# EasyEDA schematic 1-Schematic_New Projec.json
TITLE: Sheet_1; REV: 1.0; Date: 2024-03-21; Sheet: 1/1; Drawn By: rit03452; Company: Your Company
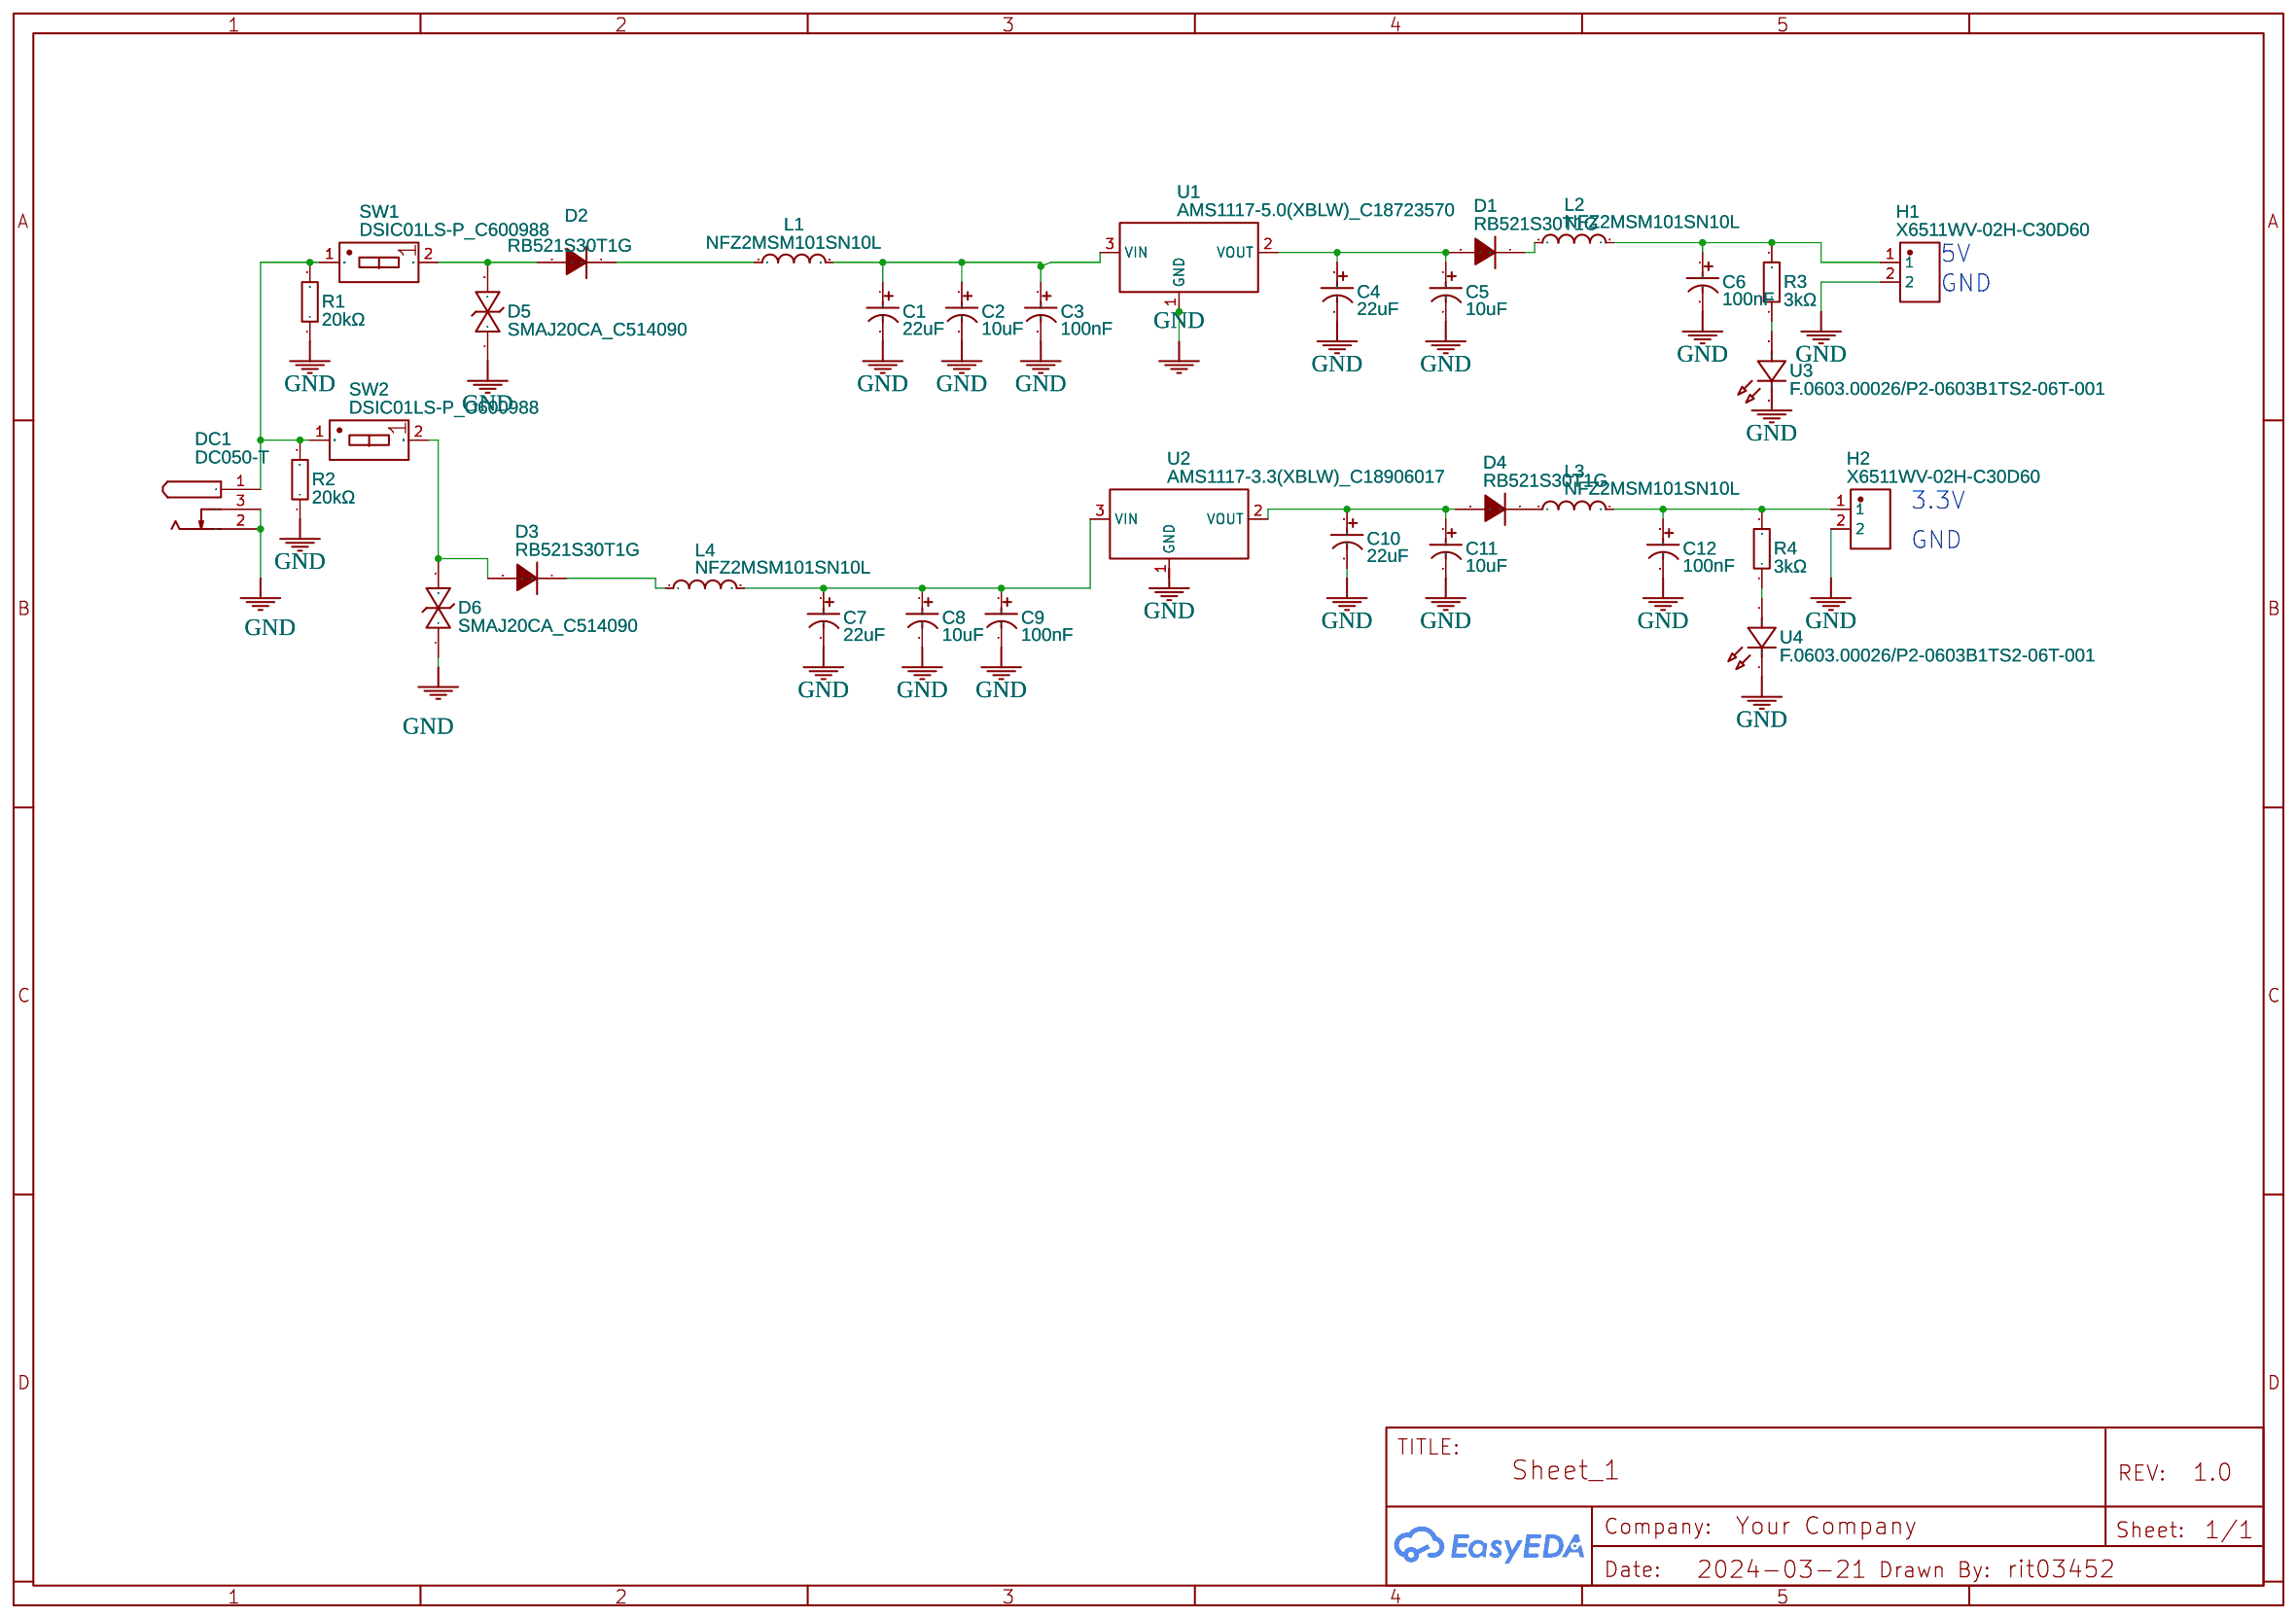
[diagram p0: schematic sheet]

## Parts
C1  22uF  [CAP-TH_BD5.0-P2.00-D0.8-FD]
C2  10uF  [CAP-TH_BD5.0-P2.00-D0.8-FD]
C3  100nF  [CAP-TH_BD5.0-P2.00-D0.8-FD]
C4  22uF  [CAP-TH_BD5.0-P2.00-D0.8-FD]
C5  10uF  [CAP-TH_BD5.0-P2.00-D0.8-FD]
C6  100nF  [CAP-TH_BD5.0-P2.00-D0.8-FD]
C7  22uF  [CAP-TH_BD5.0-P2.00-D0.8-FD]
C8  10uF  [CAP-TH_BD5.0-P2.00-D0.8-FD]
C9  100nF  [CAP-TH_BD5.0-P2.00-D0.8-FD]
C10  22uF  [CAP-TH_BD5.0-P2.00-D0.8-FD]
C11  10uF  [CAP-TH_BD5.0-P2.00-D0.8-FD]
C12  100nF  [CAP-TH_BD5.0-P2.00-D0.8-FD]
D1  RB521S30T1G  [SOD-523_L1.2-W0.8-LS1.6-RD]
D2  RB521S30T1G  [SOD-523_L1.2-W0.8-LS1.6-RD]
D3  RB521S30T1G  [SOD-523_L1.2-W0.8-LS1.6-RD]
D4  RB521S30T1G  [SOD-523_L1.2-W0.8-LS1.6-RD]
D5  SMAJ20CA_C514090  [SMA_L4.3-W2.6-LS5.2-BI]
D6  SMAJ20CA_C514090  [SMA_L4.3-W2.6-LS5.2-BI]
DC1  DC050-T  [DC-IN_DC050-T]
H1  X6511WV-02H-C30D60  [HDR-TH_2P-P2.54-V-M]
H2  X6511WV-02H-C30D60  [HDR-TH_2P-P2.54-V-M]
L1  NFZ2MSM101SN10L  [L0806]
L2  NFZ2MSM101SN10L  [L0806]
L3  NFZ2MSM101SN10L  [L0806]
L4  NFZ2MSM101SN10L  [L0806]
R1  20kΩ  [R0603]
R2  20kΩ  [R0603]
R3  3kΩ  [R0402]
R4  3kΩ  [R0402]
SW1  DSIC01LS-P_C600988  [SW-SMD_2P-L3.5-W6.2-P2.54-LS9.8]
SW2  DSIC01LS-P_C600988  [SW-SMD_2P-L3.5-W6.2-P2.54-LS9.8]
U1  AMS1117-5.0(XBLW)_C18723570  [SOT-223-3_L6.5-W3.4-P2.30-LS7.0-BR-1]
U2  AMS1117-3.3(XBLW)_C18906017  [SOT-223-3_L6.5-W3.4-P2.30-LS7.0-BR-1]
U3  F.0603.00026/P2-0603B1TS2-06T-001  [LED0603-RD]
U4  F.0603.00026/P2-0603B1TS2-06T-001  [LED0603-RD]

## Library data of the parts
C1 C4 C7 C10 = 22uF 50V 5*11: Supplier: LCSC; Manufacturer: CX(承兴); Manufacturer Part: KM226M050D11RR0VH2FP0; Supplier Part: C43346; JLCPCB Part Class: Extended Part
C2 C5 C8 C11 = 10uF 50V 5*11: Supplier: LCSC; Manufacturer: CX(承兴); Manufacturer Part: KM106M050D11RR0VH2FP0; Supplier Part: C43345; JLCPCB Part Class: Extended Part
C3 C6 C9 C12 = 0.1UF 50V: Supplier: LCSC; Manufacturer: CX(承兴); Manufacturer Part: KM104M050D11RR0VH2FP0; Supplier Part: C28061; JLCPCB Part Class: Extended Part
D1-D4 = RB521S30T1G: Contributor: LCSC; Supplier: LCSC; Supplier Part: C145179; Manufacturer: onsemi(安森美); JLCPCB Part Class: Extended Part
D5 D6 = SMAJ20CA_C514090: Contributor: LCSC; Supplier: LCSC; Supplier Part: C514090; Manufacturer: High Diode(海德); Manufacturer Part: SMAJ20CA; JLCPCB Part Class: Extended Part
DC1 = DC050-T: Contributor: LCSC; Supplier: LCSC; Supplier Part: C431534; Manufacturer: SHOU HAN(首韩); JLCPCB Part Class: Extended Part
H1 H2 = X6511WV-02H-C30D60: Contributor: LCSC; Supplier: LCSC; Supplier Part: C706874; Manufacturer: XKB Connection(中国星坤); Manufacturer Part: X6511WV-02H-C60D30; JLCPCB Part Class: Extended Part
L1-L4 = NFZ2MSM101SN10L: Contributor: lcsc; Supplier: LCSC; Supplier Part: C711203; Manufacturer: muRata(村田); JLCPCB Part Class: Extended Part
R1 R2 = 0603WAF2002T5E: Supplier: LCSC; Manufacturer: UNI-ROYAL(厚声); Supplier Part: C4184; JLCPCB Part Class: Basic Part
R3 R4 = 0402WGF3001TCE: Supplier: LCSC; Manufacturer: UNI-ROYAL(厚声); Supplier Part: C25784; JLCPCB Part Class: Extended Part
SW1 SW2 = DSIC01LS-P_C600988: Contributor: LCSC; Supplier: LCSC; Supplier Part: C600988; Manufacturer: XKB Connectivity(中国星坤); Manufacturer Part: DSIC01LS-P; JLCPCB Part Class: Extended Part
U1 = AMS1117-5.0(XBLW)_C18723570: Supplier: LCSC; Supplier Part: C18723570; Manufacturer: XBLW(芯伯乐); Manufacturer Part: AMS1117-5.0(XBLW); Contributor: lcsc
U2 = AMS1117-3.3(XBLW)_C18906017: Supplier: LCSC; Supplier Part: C18906017; Manufacturer: XBLW(芯伯乐); Manufacturer Part: AMS1117-3.3(XBLW); Contributor: lcsc
U3 U4 = F.0603.00026/P2-0603B1TS2-06T-001: Supplier: LCSC; Supplier Part: C7496819; Manufacturer: TUOZHAN(拓展光电); Contributor: lcsc; JLCPCB Part Class: Extended Part

## Nets
GND: C1.2 C2.2 C3.2 C4.2 C5.2 C6.2 C7.2 C8.2 C9.2 C10.2 C11.2 C12.2 D5.1 D6.1 DC1.2 DC1.3 H1.2 H2.2 R1.1 R2.1 U1.1(GND) U2.1(GND) U3.1(K) U4.1(K)
Net-(C1-1): C1.1 C2.1 C3.1 L1.2 U1.3(VIN)
Net-(C4-1): C4.1 C5.1 D1.2(A) U1.2(VOUT)
Net-(C6-1): C6.1 H1.1 L2.2 R3.2
Net-(C7-1): C7.1 C8.1 C9.1 L4.2 U2.3(VIN)
Net-(C10-1): C10.1 C11.1 D4.2(A) U2.2(VOUT)
Net-(C12-1): C12.1 H2.1 L3.2 R4.2
Net-(D1-1): D1.1(C) L2.1
Net-(D2-1): D2.1(C) L1.1
Net-(D2-2): D2.2(A) D5.2 SW1.2(PIN2)
Net-(D3-1): D3.1(C) L4.1
Net-(D3-2): D3.2(A) D6.2 SW2.2(PIN2)
Net-(D4-1): D4.1(C) L3.1
Net-(DC1-1): DC1.1 R1.2 R2.2 SW1.1(PIN1) SW2.1(PIN1)
Net-(R3-1): R3.1 U3.2(A)
Net-(R4-1): R4.1 U4.2(A)

## Notes on the sheet
- 5V
- GND
- 3.3V
- GND
